# EAGLE design Lan_Tap_V1 (EAGLE 9.3.0)
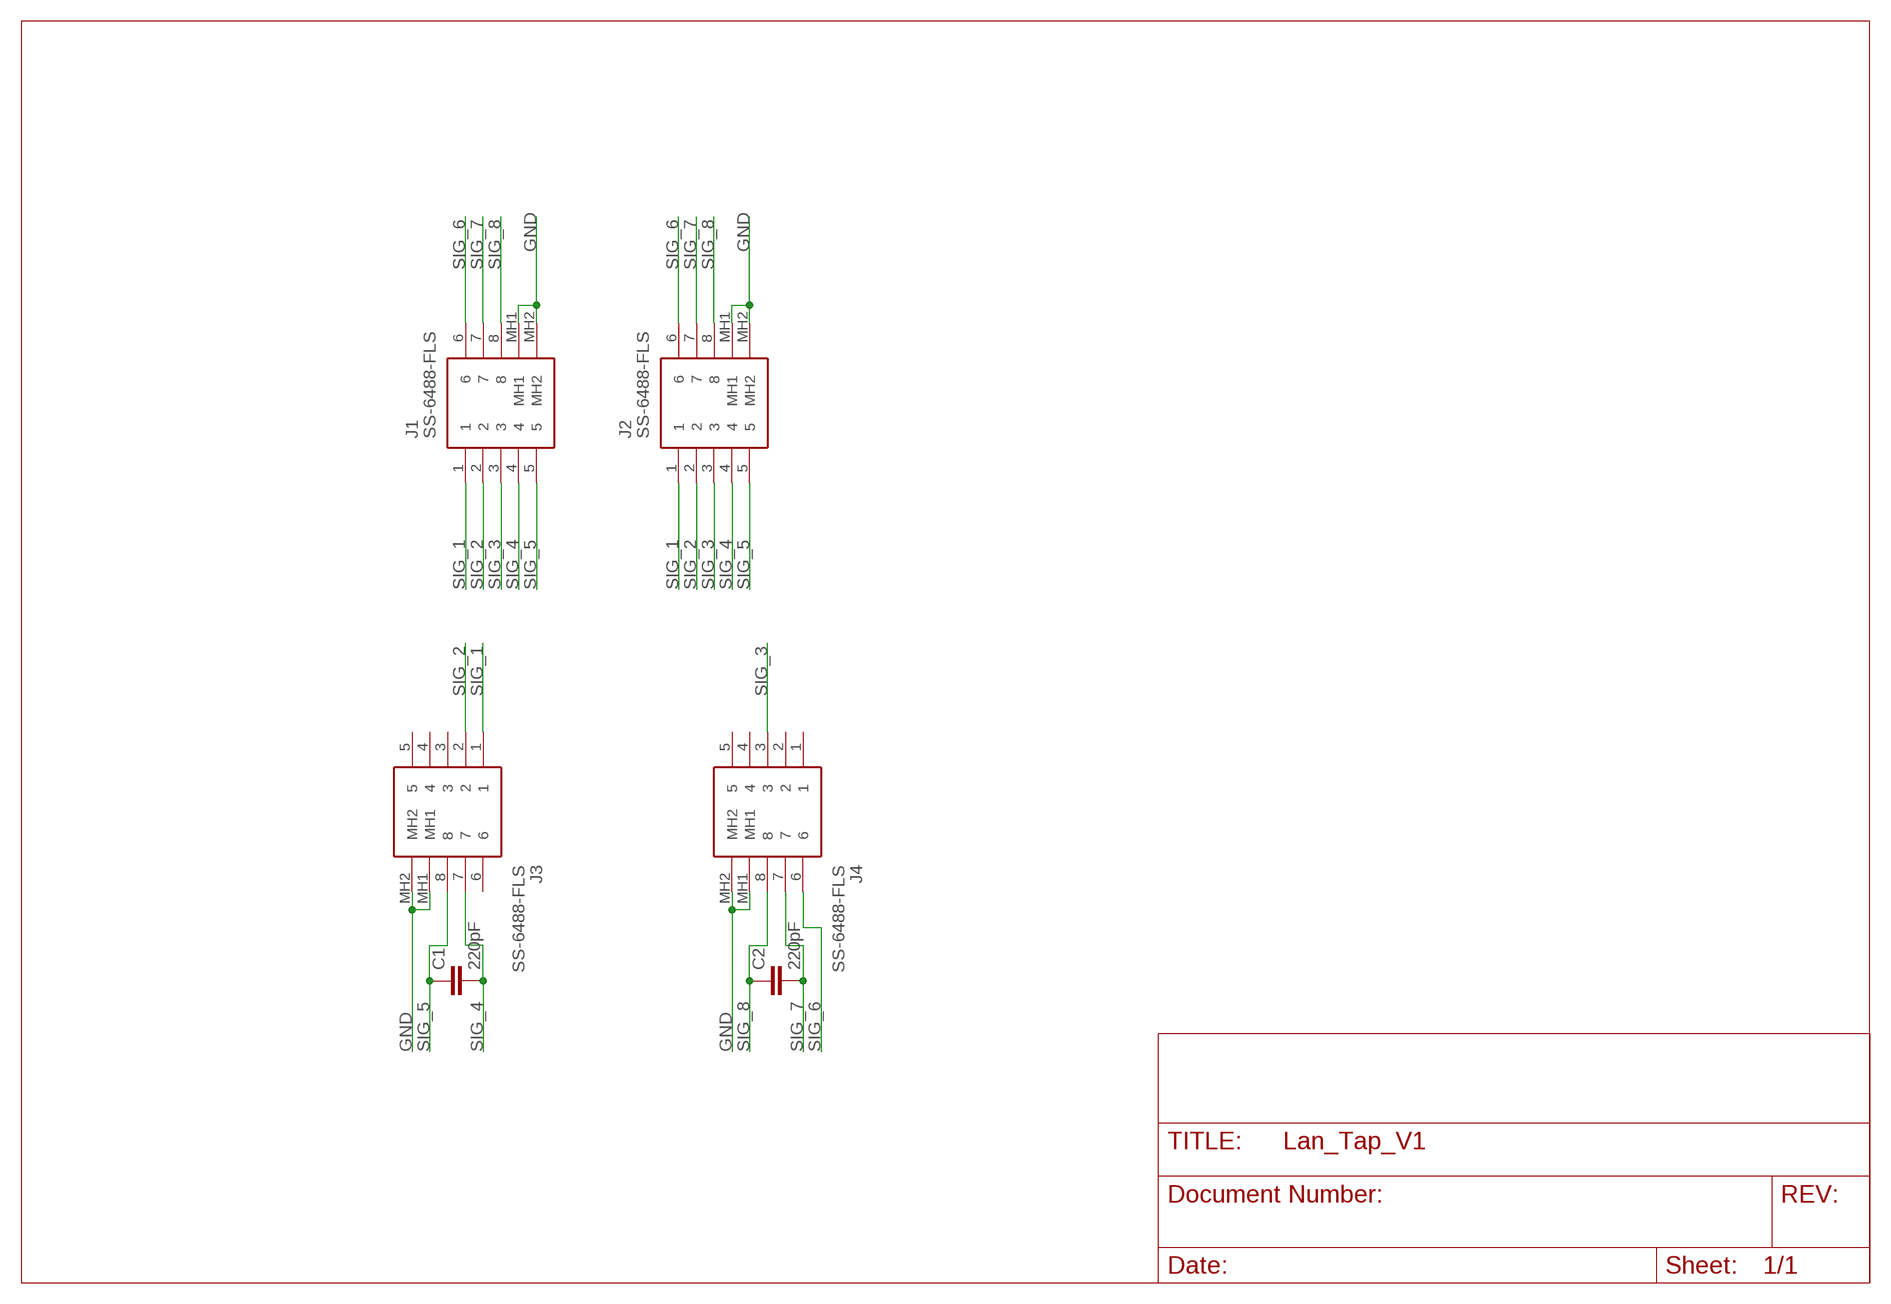
[diagram p0: schematic, sheet 1]

## Parts
C1  220pF  C2.5/2  [C2.5-2]
C2  220pF  C2.5/2  [C2.5-2]
J1  SS-6488-FLS  [SS6488FLS]
J2  SS-6488-FLS  [SS6488FLS]
J3  SS-6488-FLS  [SS6488FLS]
J4  SS-6488-FLS  [SS6488FLS]

## Nets
GND: J1.MH1 J1.MH2 J2.MH1 J2.MH2 J3.MH1 J3.MH2 J4.MH1 J4.MH2
SIG_1: J1.1 J2.1 J3.1
SIG_2: J1.2 J2.2 J3.2
SIG_3: J1.3 J2.3 J4.3
SIG_4: C1.2 J1.4 J2.4 J3.7
SIG_5: C1.1 J1.5 J2.5 J3.8
SIG_6: J1.6 J2.6 J4.6
SIG_7: C2.2 J1.7 J2.7 J4.7
SIG_8: C2.1 J1.8 J2.8 J4.8
Unconnected: J3.3 J3.4 J3.5 J3.6 J4.1 J4.2 J4.4 J4.5

## Library data of the parts
C1 C2 = capacitor-wima:C: CAPACITOR naming: grid - package width
J1-J4 = SS-6488-FLS:SS-6488-FLS: Conn Modular Jack F 8 POS 2.54mm Solder RA Thru-Hole 8 Terminal 1 Port Source: Datasheet <https://www.arrow.com/en/products/ss-6488-fls/bel-group>; ARROW_PART_NUMBER: SS-6488-FLS; ARROW_PRICE-STOCK: https://www.arrow.com/en/products/ss-6488-fls/stewart-connector-systems; DESCRIPTION: Conn Modular Jack F 8 POS 2.54mm Solder RA Thru-Hole 8 Terminal 1 Port; HEIGHT: 12.82mm; MANUFACTURER_NAME: Stewart Connector; MANUFACTURER_PART_NUMBER: SS-6488-FLS; MOUSER_PART_NUMBER: 530-SS-6488-FLS; MOUSER_PRICE-STOCK: https://www.mouser.co.uk/ProductDetail/Stewart-Connector-Bel/SS-6488-FLS?qs=SRYZG9HaIQ3YBlnIutds%252BA%3D%3D

## Board
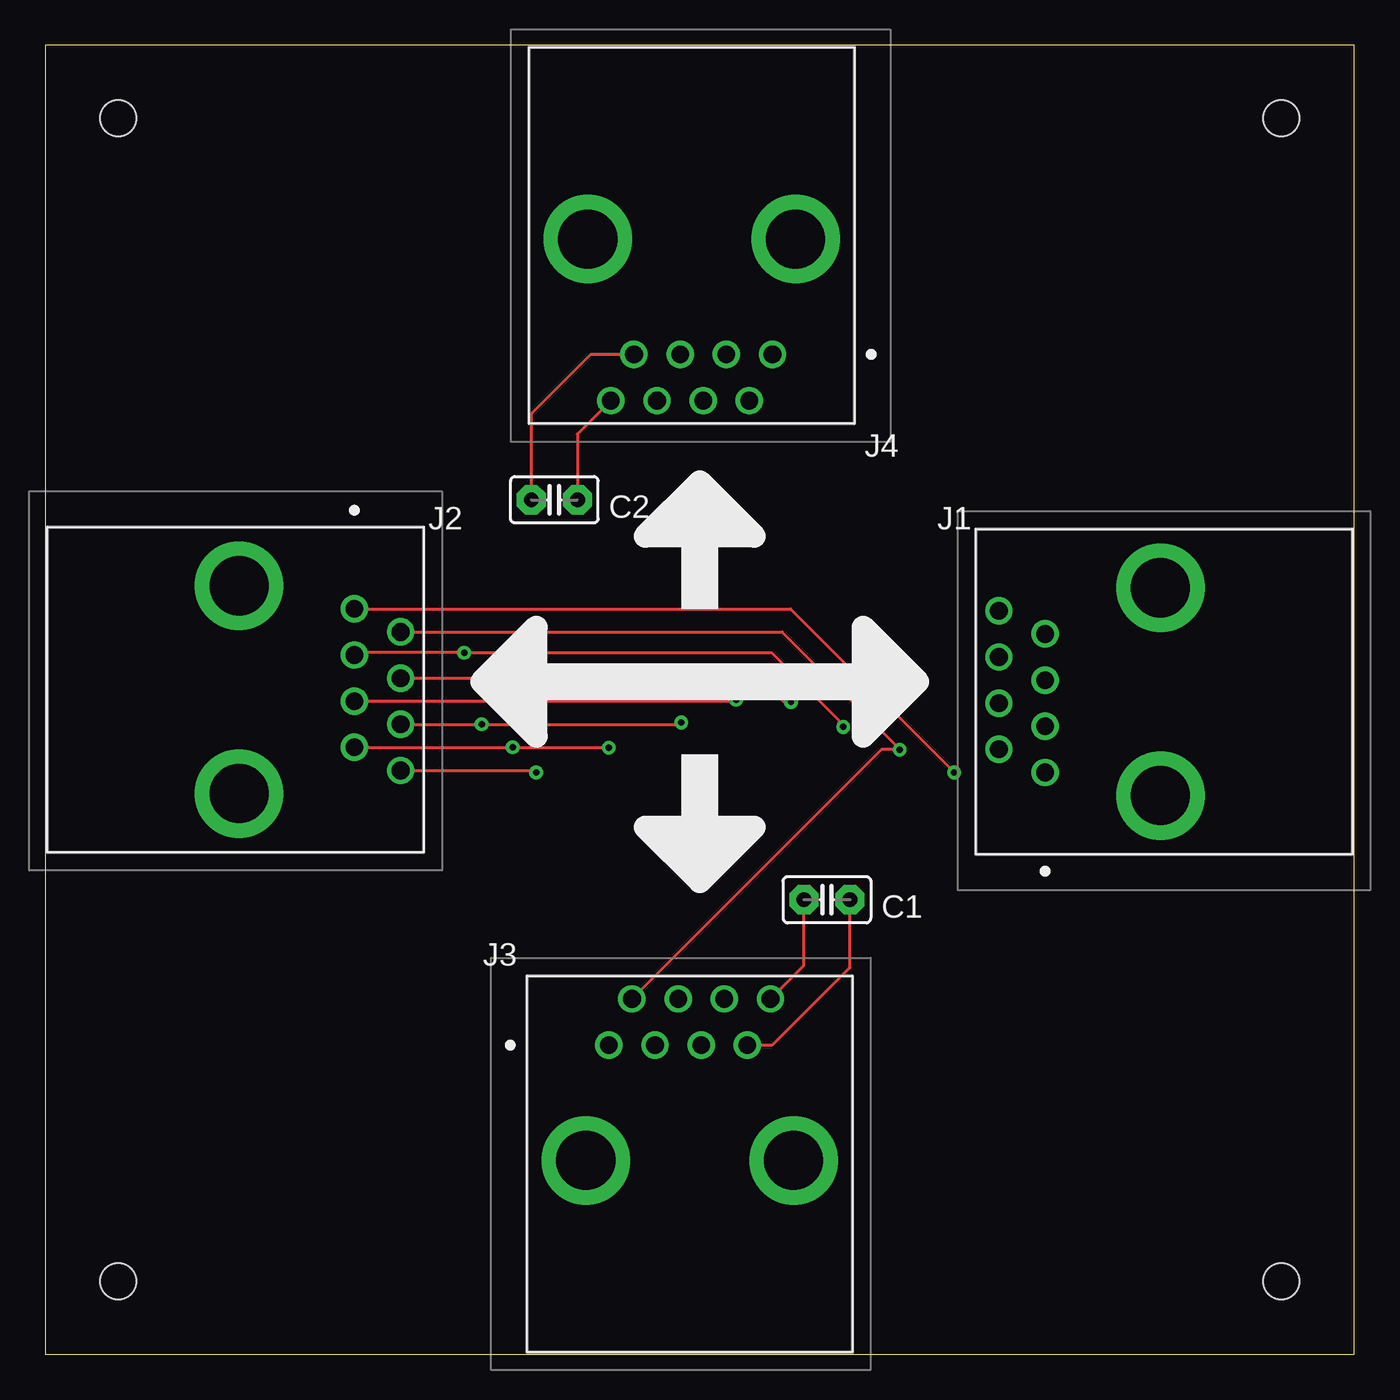
[diagram p1: board, top side]
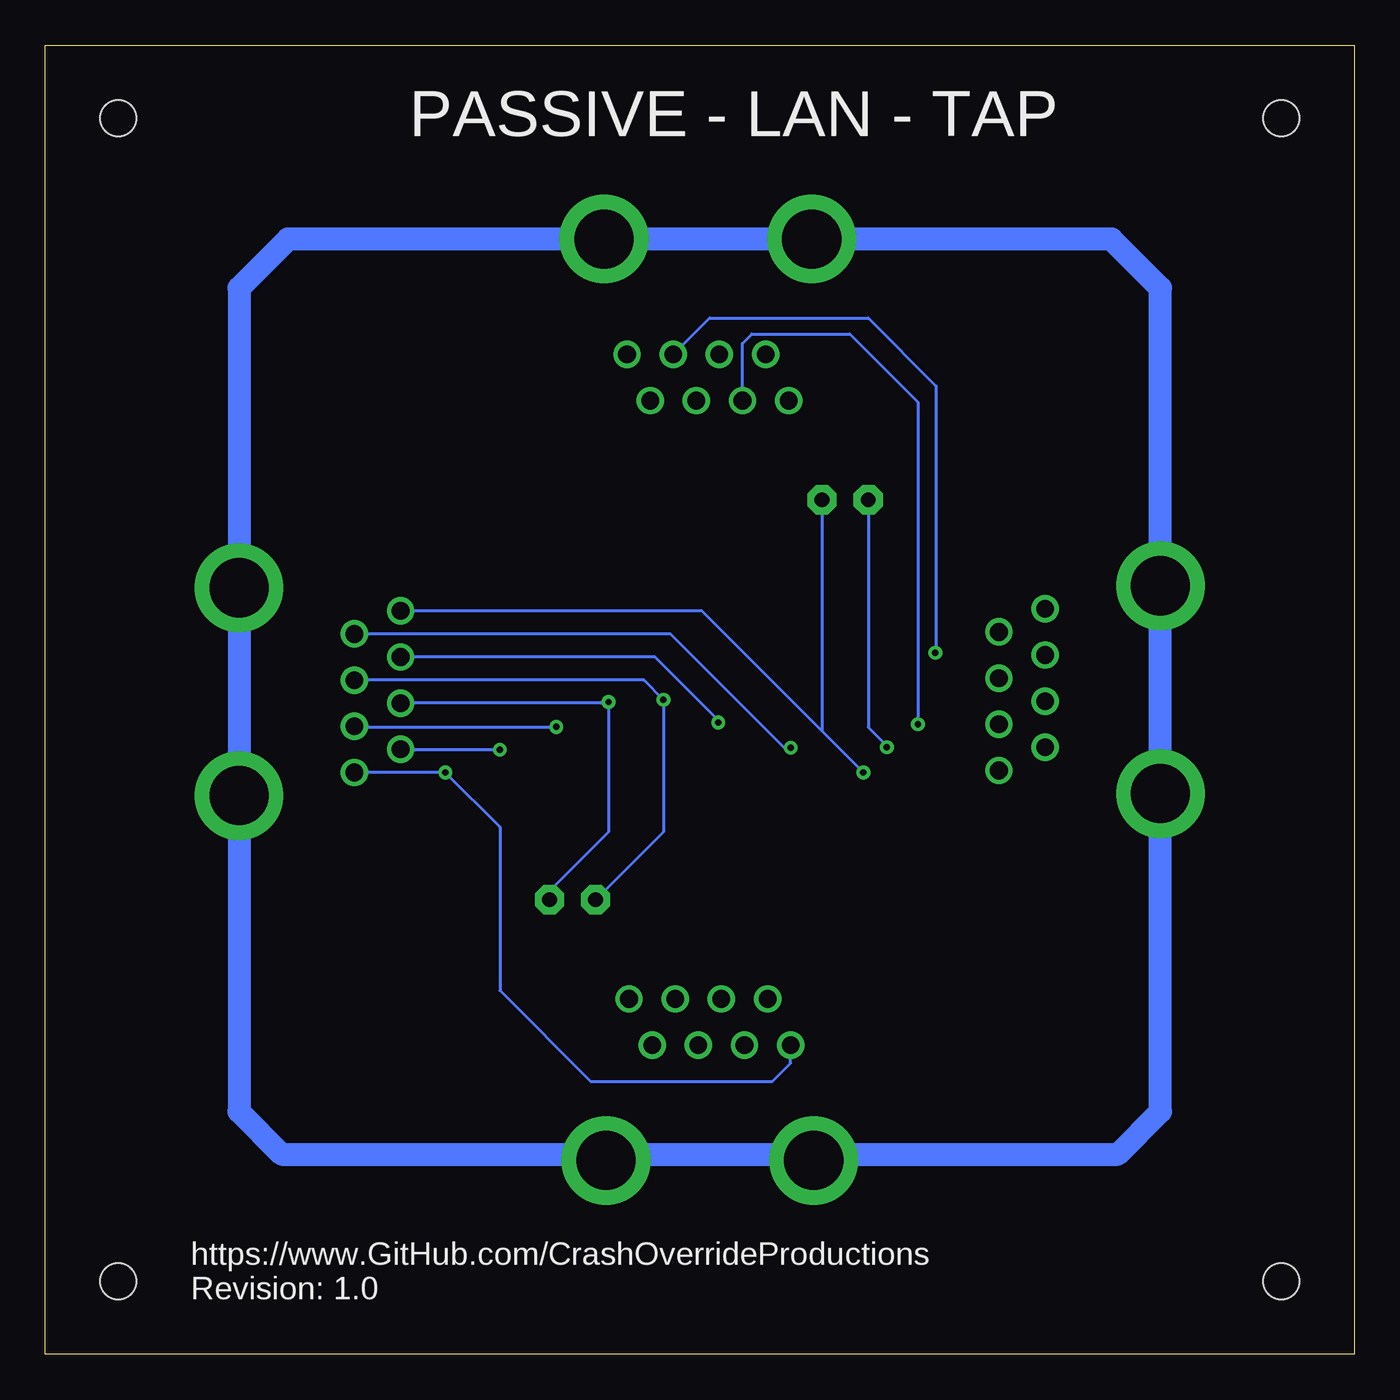
[diagram p2: board, bottom side, seen from below]

Size 72 x 72 mm. Coordinates in mm from the lower left corner, seen from the top.
Outline: 0,0 72,0 72,72 0,72 0,0
Copper layers (1*16): Top 0.035mm / dielectric 1.5mm / Bottom 0.035mm
Design rules "default": minimum track width 6mil, minimum drill 0.35mm, track to track 6mil, track to pad 6mil, pad to pad 6mil, via to via 6mil, smd to smd 6mil, copper to edge 40mil, drill to drill 6mil, minimum pad ring 10mil, minimum via ring 8mil, stop-mask expansion 4mil, vias tented up to drill 0mil, thermal gap 10mil
Holes 2 mm at 4,68 68,68 4,4 68,4

### Footprints (pad centres in the part's own frame; a part is rotated, then mirrored left to right if it is on the bottom)
C2.5-2 = drill 0.813 pad 1.6 octagon: 1 -1.27,0; 2 1.27,0
SS6488FLS = drill 0.97 pad 1.509: 1 0,0; 2 1.27,2.54; 3 2.54,0; 4 3.81,2.54; 5 5.08,0; 6 6.35,2.54; 7 7.62,0; 8 8.89,2.54 | drill 3.25 pad 4.875: MH1 -1.27,-6.35; MH2 10.16,-6.35

### Placement (x,y rotation side)
C1  43,25 0 top
C2  28,47 180 top
J1  55,32 90 top
J2  17,41 270 top
J3  31,17 0 top
J4  40,55 180 top

### Tracks (layer width: path | path; a pad name or v marks a point on that pad's centre or on a via)
GND
  Bottom 1.27: J4.MH1 J4.MH2 13.35,61.35 10.65,58.65 J2.MH1 J2.MH2 10.65,13.35 13,11 29.38,11 J3.MH1 30.08,11 40.81,11 J3.MH2 41.16,10.84 | 42,61 41.65,61.35 J4.MH1 | J4.MH1 58.65,61.35 61.35,58.65 J1.MH2 J1.MH1 61.35,13.35 59,11 41,11 41.16,10.84 | 40,10 42,10 41.16,10.84
SIG_1  (via drill 0.35)
  Top 0.152: J2.1 41,41 v50,32
  Bottom 0.152: J1.1 v50,32 47,29 47,20 42,15 32,15 31,16 J3.1
SIG_2  (via drill 0.35)
  Top 0.152: J2.2 40.52,39.73 v47,33.25 45.98,33.25 J3.2
  Bottom 0.152: v47,33.25 52.44,33.25 J1.2
SIG_3  (via drill 0.35)
  Top 0.152: J2.3 17.13,38.59 v23.04,38.59 39.94,38.59 43.89,34.63 v43.89,34.51
  Bottom 0.152: J1.3 54.97,34.51 v43.89,34.51 | J4.3 35.46,57 26.73,57 23,53.27 23,38.63 v23.04,38.59
SIG_4  (via drill 0.35)
  Top 0.152: J3.7 40,17 44.27,21.27 C1.2 44.27,25.38 | J2.4 39.32,37.19 40.63,35.87 v41.02,35.87
  Bottom 0.152: J1.4 41.08,35.81 v41.02,35.87 41.02,28.74 44.27,25.48 C1.2
SIG_5  (via drill 0.35)
  Top 0.152: J3.8 41.73,21.38 C1.1 | J2.5 37.92,35.92 v38,36
  Bottom 0.152: J1.5 39.08,37.08 v38,36 38,28.73 C1.1
SIG_6  (via drill 0.35)
  Top 0.152: J2.6 v24,34.65 34.98,34.65 v34.98,34.75
  Bottom 0.152: v34.98,34.75 34.98,34.87 38.46,38.35 J1.6 | J4.6 33.65,55.6 33.13,56.13 27.75,56.13 24,52.38 v24,34.65
SIG_7  (via drill 0.35)
  Top 0.152: J4.7 30,55 26.73,51.73 C2.2 | J2.7 v25.71,33.38 v31,33.38 v31,33.37
  Bottom 0.152: v31,33.37 31.37,33.37 37.62,39.62 J1.7 | C2.2 26.73,34.48 25.71,33.45 v25.71,33.38
SIG_8  (via drill 0.35)
  Top 0.152: J4.8 29.27,50.62 C2.1 | J2.8 26.89,32.11 v27,32
  Bottom 0.152: 29.27,34.27 35.89,40.89 J1.8 | v27,32 27.5,32.5 29.27,34.27 | C2.1 29.27,34.27

### Text on the board
bPlace: PASSIVE - LAN - TAP | https://www.GitHub.com/CrashOverrideProductions / Revision: 1.0